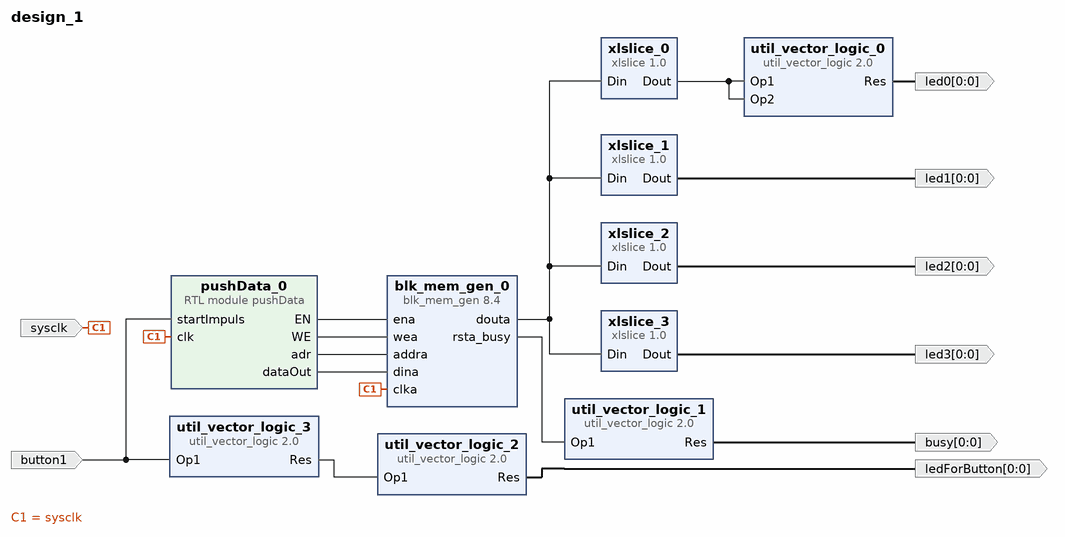
[diagram p0: block diagram of the top level]
# Vivado block design design_1, xc7a15tcpg236-1, Vivado 2021.1
create_bd_design design_1

create_bd_port -dir I -type clk sysclk
set_property -dict {CONFIG.FREQ_HZ 12000000} [get_bd_ports sysclk]
create_bd_port -dir I -type data button1
create_bd_port -dir O -from 0 -to 0 led1
create_bd_port -dir O -from 0 -to 0 led2
create_bd_port -dir O -from 0 -to 0 led3
create_bd_port -dir O -from 0 -to 0 -type data busy
create_bd_port -dir O -from 0 -to 0 -type data led0
create_bd_port -dir O -from 0 -to 0 -type data ledForButton

create_bd_cell -type ip -vlnv xilinx.com:ip:blk_mem_gen:8.4 blk_mem_gen_0
set_property -dict [list \
  CONFIG.EN_SAFETY_CKT true \
  CONFIG.Enable_32bit_Address true \
  CONFIG.Register_PortA_Output_of_Memory_Primitives false \
  CONFIG.Use_RSTA_Pin true \
  CONFIG.use_bram_block BRAM_Controller \
] [get_bd_cells blk_mem_gen_0]
create_bd_cell -type ip -vlnv xilinx.com:ip:xlslice:1.0 xlslice_0
set_property -dict {CONFIG.DIN_FROM 0 CONFIG.DIN_TO 0 CONFIG.DOUT_WIDTH 1} [get_bd_cells xlslice_0]
create_bd_cell -type ip -vlnv xilinx.com:ip:xlslice:1.0 xlslice_1
set_property -dict {CONFIG.DIN_FROM 1 CONFIG.DIN_TO 1 CONFIG.DOUT_WIDTH 1} [get_bd_cells xlslice_1]
create_bd_cell -type ip -vlnv xilinx.com:ip:xlslice:1.0 xlslice_2
set_property -dict {CONFIG.DIN_FROM 2 CONFIG.DIN_TO 2 CONFIG.DOUT_WIDTH 1} [get_bd_cells xlslice_2]
create_bd_cell -type ip -vlnv xilinx.com:ip:xlslice:1.0 xlslice_3
set_property -dict {CONFIG.DIN_FROM 3 CONFIG.DIN_TO 3 CONFIG.DOUT_WIDTH 1} [get_bd_cells xlslice_3]
create_bd_cell -type ip -vlnv xilinx.com:ip:util_vector_logic:2.0 util_vector_logic_0
set_property -dict {CONFIG.C_OPERATION or CONFIG.C_SIZE 1} [get_bd_cells util_vector_logic_0]
create_bd_cell -type ip -vlnv xilinx.com:ip:util_vector_logic:2.0 util_vector_logic_1
set_property -dict {CONFIG.C_OPERATION not CONFIG.C_SIZE 1} [get_bd_cells util_vector_logic_1]
create_bd_cell -type ip -vlnv xilinx.com:ip:util_vector_logic:2.0 util_vector_logic_2
set_property -dict {CONFIG.C_OPERATION not CONFIG.C_SIZE 1} [get_bd_cells util_vector_logic_2]
create_bd_cell -type ip -vlnv xilinx.com:ip:util_vector_logic:2.0 util_vector_logic_3
set_property -dict {CONFIG.C_OPERATION not CONFIG.C_SIZE 1} [get_bd_cells util_vector_logic_3]
create_bd_cell -type module -reference pushData pushData_0

# ---- connections ----

connect_bd_net [get_bd_pins blk_mem_gen_0/douta] \
  [get_bd_pins xlslice_0/Din] [get_bd_pins xlslice_1/Din] [get_bd_pins xlslice_2/Din] [get_bd_pins xlslice_3/Din]
connect_bd_net [get_bd_pins blk_mem_gen_0/rsta_busy] [get_bd_pins util_vector_logic_1/Op1]
connect_bd_net -net button1_1 [get_bd_ports button1] [get_bd_pins util_vector_logic_3/Op1] [get_bd_pins pushData_0/startImpuls]
connect_bd_net [get_bd_pins pushData_0/EN] [get_bd_pins blk_mem_gen_0/ena]
connect_bd_net [get_bd_pins pushData_0/WE] [get_bd_pins blk_mem_gen_0/wea]
connect_bd_net [get_bd_pins pushData_0/adr] [get_bd_pins blk_mem_gen_0/addra]
connect_bd_net [get_bd_pins pushData_0/dataOut] [get_bd_pins blk_mem_gen_0/dina]
connect_bd_net [get_bd_ports sysclk] [get_bd_pins blk_mem_gen_0/clka] [get_bd_pins pushData_0/clk]
connect_bd_net [get_bd_pins util_vector_logic_0/Res] [get_bd_ports led0]
connect_bd_net [get_bd_pins util_vector_logic_1/Res] [get_bd_ports busy]
connect_bd_net [get_bd_pins util_vector_logic_2/Res] [get_bd_ports ledForButton]
connect_bd_net [get_bd_pins util_vector_logic_3/Res] [get_bd_pins util_vector_logic_2/Op1]
connect_bd_net [get_bd_pins xlslice_0/Dout] [get_bd_pins util_vector_logic_0/Op1] [get_bd_pins util_vector_logic_0/Op2]
connect_bd_net [get_bd_pins xlslice_1/Dout] [get_bd_ports led1]
connect_bd_net [get_bd_pins xlslice_2/Dout] [get_bd_ports led2]
connect_bd_net [get_bd_pins xlslice_3/Dout] [get_bd_ports led3]

set_property USER_COMMENTS.comment_1 {when started by button1:
kicks out a 32 bit word and 32 bit adress
every 3 clocks.
first wait for 3 clocks then first word comes out

dataIn is not used in this RTL} [current_bd_design]
set_property USER_COMMENTS.comment_0 {wea needs to be 1111 
addra: current adress
clka: clocka
dina: data input
dout: dataoutput
ena: ?? enable?
rsta: reset a...
wea: ???
} [get_bd_cells /blk_mem_gen_0]

validate_bd_design
save_bd_design
